# EAGLE design mm8i (EAGLE 6.6.0)
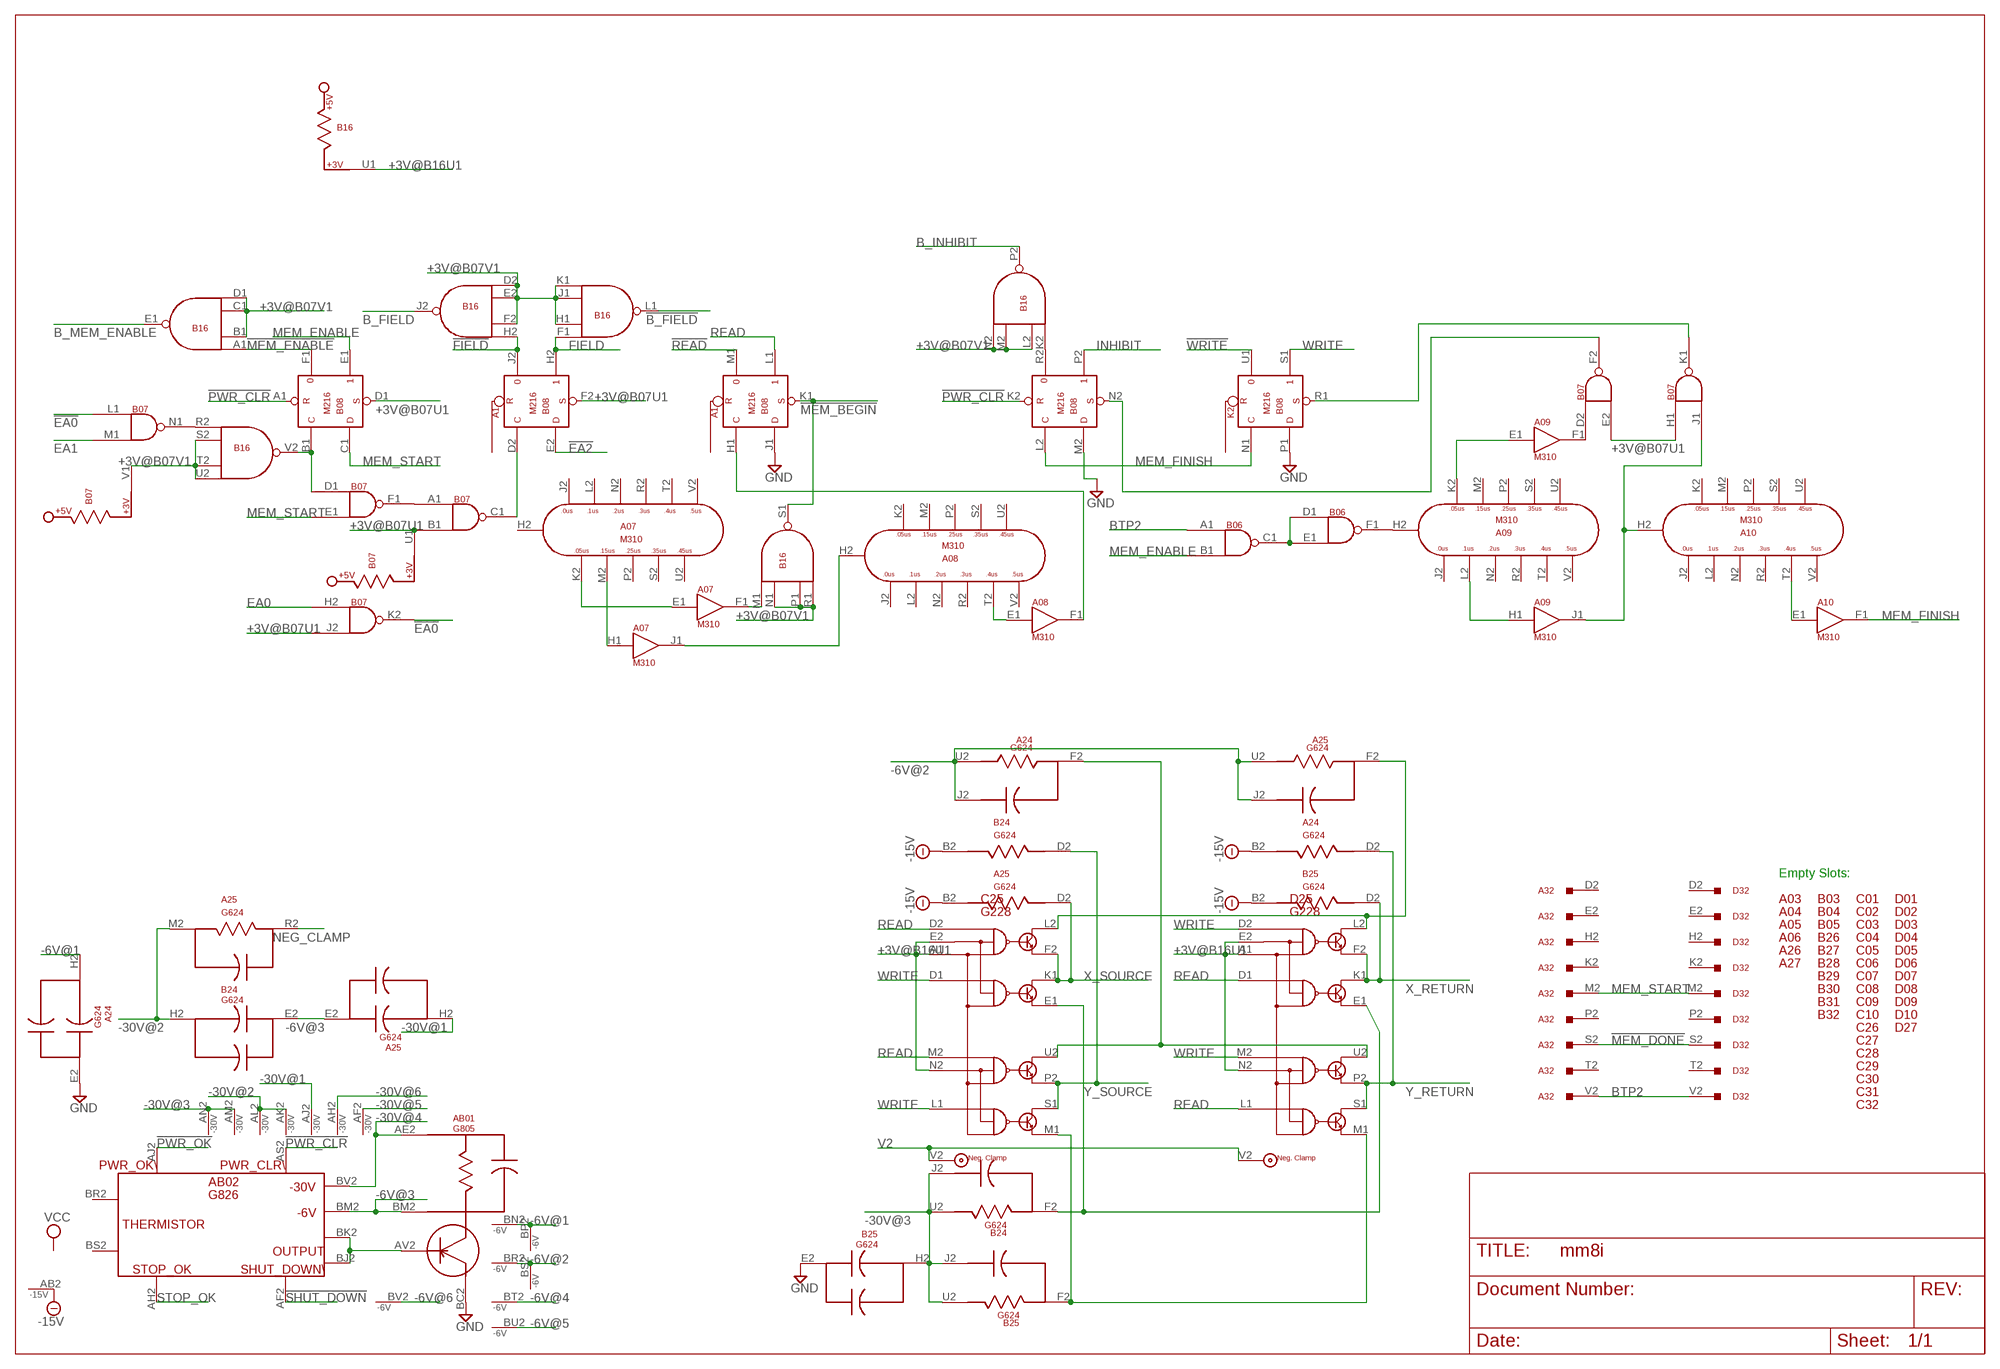
[diagram p0: schematic, sheet 1]

## Parts
A03  H807  [H807]
A04  H807  [H807]
A05  H807  [H807]
A06  H807  [H807]
A07  M310  [H807]
A08  M310  [H807]
A09  M310  [H807]
A10  M310  [H807]
A24  G624  [H807]
A25  G624  [H807]
A26  H807  [H807]
A27  H807  [H807]
A32  W033  W011  [H807]
AB01  G805  [H807-2]
AB02  G826  [H807-2]
B03  H807  [H807]
B04  H807  [H807]
B05  H807  [H807]
B06  M113  [H807]
B07  M113  [H807]
B08  M216  M206X  [H807]
B16  M617  [H807]
B24  G624  [H807]
B25  G624  [H807]
B26  H807  [H807]
B27  H807  [H807]
B28  H807  [H807]
B29  H807  [H807]
B30  H807  [H807]
B31  H807  [H807]
B32  H807  [H807]
C01  H807  [H807]
C02  H807  [H807]
C03  H807  [H807]
C04  H807  [H807]
C05  H807  [H807]
C06  H807  [H807]
C07  H807  [H807]
C08  H807  [H807]
C09  H807  [H807]
C10  H807  [H807]
C25  G228  [H807]
C26  H807  [H807]
C27  H807  [H807]
C28  H807  [H807]
C29  H807  [H807]
C30  H807  [H807]
C31  H807  [H807]
C32  H807  [H807]
D01  H807  [H807]
D02  H807  [H807]
D03  H807  [H807]
D04  H807  [H807]
D05  H807  [H807]
D06  H807  [H807]
D07  H807  [H807]
D08  H807  [H807]
D09  H807  [H807]
D10  H807  [H807]
D25  G228  [H807]
D27  H807  [H807]
D32  W033  W011  [H807]

## Nets
!B_FIELD: B16.L1(L1:OUT)
!EA0: B07.K2(K2:OUT) B07.L1(N1:IN1)
!EA2: B08.E2(H2:D)
!FIELD: B08.J2 B16.H2(J2:IN4)
!MEM_BEGIN: B08.K1(L1:S) B16.S1(S1:OUT)
!MEM_DONE: A32.S2 D32.S2
!MEM_ENABLE: B08.F1 B16.A1(E1:IN1)
!PWR_CLR: AB02.AS2 B08.A1(E1:R) B08.K2(P2:R)
!PWR_OK: AB02.AJ2
!READ: B08.M1
!SHUT_DOWN: AB02.AF2
!WRITE: B08.U1
+3V@B07U1: B07.B1(C1:IN2) B07.E2(F2:IN2) B07.H1(K1:IN1) B07.J2(K2:IN2) B07.U1 B08.D1(E1:S) B08.F2(H2:S)
+3V@B07V1: B07.V1 B16.B1(E1:IN2) B16.C1(E1:IN3) B16.D1(E1:IN4) B16.D2(J2:IN1) B16.E2(J2:IN2) B16.F2(J2:IN3) B16.H1(L1:IN2) B16.J1(L1:IN3) B16.K1(L1:IN4) B16.L2(P2:IN2) B16.M2(P2:IN3) B16.N1(S1:IN2) B16.N2(P2:IN4) B16.P1(S1:IN3) B16.R1(S1:IN4) B16.S2(V2:IN2) B16.T2(V2:IN3) B16.U2(V2:IN4)
+3V@B16U1: B16.U1 C25.A1 C25.E2 C25.N2 D25.A1 D25.E2 D25.N2
-6V@1: A24.H2 AB01.BN2(-6V) AB01.BP2(-6V)
-6V@2: A24.J2 A24.U2 A25.J2 A25.U2 AB01.BR2(-6V) AB01.BS2(-6V)
-6V@3 [supply]: A25.E2 AB01.BM2(-6V) AB02.BM2(-6V) B24.E2
-6V@4: AB01.BT2(-6V)
-6V@5: AB01.BU2(-6V)
-6V@6: AB01.BV2(-6V)
-15V: A24.B2 A25.B2 AB02.AB2(-15V) B24.B2 B25.B2
-30V@1: A25.H2 AB01.AJ2(-30V)
-30V@2: A25.M2 AB01.AK2(-30V) AB01.AL2(-30V) B24.H2
-30V@3: AB01.AM2(-30V) AB01.AN2(-30V) B24.J2 B24.U2 B25.H2 B25.J2 B25.U2
-30V@4 [supply]: AB01.AE2(-30V) AB02.BV2(-30V)
-30V@5: AB01.AF2(-30V)
-30V@6: AB01.AH2(-30V)
B_FIELD: B16.J2(J2:OUT)
B_INHIBIT: B16.P2(P2:OUT)
B_MEM_ENABLE: B16.E1(E1:OUT)
BTP2: A32.V2 B06.A1(C1:IN1) D32.V2
EA0: B07.H2(K2:IN1)
EA1: B07.M1(N1:IN2)
FIELD: B08.H2 B16.F1(L1:IN1)
GND [supply]: A24.E2 AB01.BC2(GND) B08.J1(L1:D) B08.M2(P2:D) B08.P1(S1:D) B25.E2
INHIBIT: B08.P2
MEM_ENABLE: B06.B1(C1:IN2) B08.E1
MEM_FINISH: A10.F1(F1:OUT) B08.L2(P2:C) B08.N1(S1:C)
MEM_START: A32.M2 B07.E1(F1:IN2) B08.C1(E1:D) D32.M2
N$1: AB01.AV2 AB02.BJ2 AB02.BK2
N$2: B06.C1(C1:OUT) B06.D1(F1:IN1) B06.E1(F1:IN2)
N$3: A25.F2 C25.L2 D25.L2
N$4: A24.F2 C25.U2 D25.U2
N$5: B07.N1(N1:OUT) B16.R2(V2:IN1)
N$6: B07.D1(F1:IN1) B08.B1(E1:C) B16.V2(V2:OUT)
N$7: B07.A1(C1:IN1) B07.F1(F1:OUT)
N$8: B07.C1(C1:OUT) B08.D2(H2:C)
N$9: A07.H1(J1:IN) A07.M2(H2:M2)
N$10: A07.E1(F1:IN) A07.K2(H2:K2)
N$11: A07.F1(F1:OUT) B16.M1(S1:IN1)
N$12: A07.J1(J1:OUT) A08.H2(H2:H2)
N$13: A08.E1(F1:IN) A08.T2(H2:T2)
N$14: A08.F1(F1:OUT) B08.H1(L1:C)
N$15: A09.H2(H2:H2) B06.F1(F1:OUT)
N$16: A09.E1(F1:IN) A09.K2(H2:K2)
N$17: A09.H1(J1:IN) A09.L2(H2:L2)
N$18: A09.F1(F1:OUT) B07.D2(F2:IN1)
N$19: B25.F2 C25.M1 D25.M1
N$20: B24.F2 C25.E1 D25.E1
N$21: B07.F2(F2:OUT) B08.N2(P2:S)
N$22: B08.R2 B16.K2(P2:IN1)
N$23: A09.J1(J1:OUT) A10.H2(H2:H2) B07.J1(K1:IN2)
N$24: A10.E1(F1:IN) A10.T2(H2:T2)
N$25: B07.K1(K1:OUT) B08.R1(S1:S)
NEG_CLAMP: A25.R2
READ: B08.L1 C25.D2 C25.M2 D25.D1 D25.L1
STOP_OK: AB02.AH2
V2: C25.V2 D25.V2
WRITE: B08.S1 C25.D1 C25.L1 D25.D2 D25.M2
X_RETURN: B25.D2 D25.F2 D25.K1
X_SOURCE: A25.D2 C25.F2 C25.K1
Y_RETURN: A24.D2 D25.P2 D25.S1
Y_SOURCE: B24.D2 C25.P2 C25.S1
Unconnected: A07.H2(H2:H2) A07.J2(H2:J2) A07.L2(H2:L2) A07.N2(H2:N2) A07.P2(H2:P2) A07.R2(H2:R2) A07.S2(H2:S2) A07.T2(H2:T2) A07.U2(H2:U2) A07.V2(H2:V2) A08.H1(J1:IN) A08.J1(J1:OUT) A08.J2(H2:J2) A08.K2(H2:K2) A08.L2(H2:L2) A08.M2(H2:M2) A08.N2(H2:N2) A08.P2(H2:P2) A08.R2(H2:R2) A08.S2(H2:S2) A08.U2(H2:U2) A08.V2(H2:V2) A09.J2(H2:J2) A09.M2(H2:M2) A09.N2(H2:N2) A09.P2(H2:P2) A09.R2(H2:R2) A09.S2(H2:S2) A09.T2(H2:T2) A09.U2(H2:U2) A09.V2(H2:V2) A10.H1(J1:IN) A10.J1(J1:OUT) A10.J2(H2:J2) A10.K2(H2:K2) A10.L2(H2:L2) A10.M2(H2:M2) A10.N2(H2:N2) A10.P2(H2:P2) A10.R2(H2:R2) A10.S2(H2:S2) A10.U2(H2:U2) A10.V2(H2:V2) A24.C2 A24.K2 A24.L2 A24.M2 A24.N2 A24.P2 A24.R2 A24.S2 A24.T2 A24.V2 A25.C2 A25.K2 A25.L2 A25.N2 A25.P2 A25.S2 A25.T2 A25.V2 A32.D2 A32.E2 A32.H2 A32.K2 A32.P2 A32.T2 AB02.BR2 AB02.BS2 B06.D2(F2:IN1) B06.E2(F2:IN2) B06.F2(F2:OUT) B06.H1(K1:IN1) B06.H2(K2:IN1) B06.J1(K1:IN2) B06.J2(K2:IN2) B06.K1(K1:OUT) B06.K2(K2:OUT) B06.L1(N1:IN1) B06.L2(N2:IN1) B06.M1(N1:IN2) B06.M2(N2:IN2) B06.N1(N1:OUT) B06.N2(N2:OUT) B06.P1(S1:IN1) B06.P2(S2:IN1) B06.R1(S1:IN2) B06.R2(S2:IN2) B06.S1(S1:OUT) B06.S2(S2:OUT) B06.T2(V2:IN1) B06.U1 B06.U2(V2:IN2) B06.V1 B06.V2(V2:OUT) B07.L2(N2:IN1) B07.M2(N2:IN2) B07.N2(N2:OUT) B07.P1(S1:IN1) B07.P2(S2:IN1) B07.R1(S1:IN2) B07.R2(S2:IN2) B07.S1(S1:OUT) B07.S2(S2:OUT) B07.T2(V2:IN1) B07.U2(V2:IN2) B07.V2(V2:OUT) B08.S2(V2:C) B08.T2(V2:D) B08.U2(V2:S) B08.V1 B08.V2 B16.V1 B24.C2 B24.K2 B24.L2 B24.M2 B24.N2 B24.P2 B24.R2 B24.S2 B24.T2 B24.V2 B25.C2 B25.K2 B25.L2 B25.M2 B25.N2 B25.P2 B25.R2 B25.S2 B25.T2 B25.V2 C25.F1(F1:H) C25.H1(F1:J) C25.H2(H2:H) C25.J1(F1:K) C25.J2(H2:J) C25.K2(H2:K) C25.N1(N1:H) C25.P1(N1:J) C25.R1(N1:K) C25.R2(R2:H) C25.S2(R2:J) C25.T2(R2:K) D25.F1(F1:H) D25.H1(F1:J) D25.H2(H2:H) D25.J1(F1:K) D25.J2(H2:J) D25.K2(H2:K) D25.N1(N1:H) D25.P1(N1:J) D25.R1(N1:K) D25.R2(R2:H) D25.S2(R2:J) D25.T2(R2:K) D32.D2 D32.E2 D32.H2 D32.K2 D32.P2 D32.T2

## Notes on the sheet
- Empty Slots:

## Power pins joined to a net without a drawn wire
GND: A07.C2(GND) A07.T1(GND) A08.C2(GND) A08.T1(GND) A09.C2(GND) A09.T1(GND) A10.C2(GND) A10.T1(GND) A32.C2 A32.F2 A32.J2 A32.L2 A32.N2 A32.R2 A32.U2 AB01.AP2(GND) AB01.AR2(GND) AB01.AS2(GND) AB01.AT2(GND) AB01.AU2(GND) AB01.BD2(GND) AB01.BE2(GND) AB01.BF2(GND) AB01.BH2(GND) AB01.BJ2(GND) AB01.BK2(GND) AB01.BL2(GND) AB02.AC2(GND) AB02.BC2(GND) B06.C2(GND) B06.T1(GND) B07.C2(GND) B07.T1(GND) B08.C2(GND) B08.T1(GND) B16.C2(GND) B16.T1(GND) C25.C2(C2:GND) C25.T1(T1:GND) D25.C2(C2:GND) D25.T1(T1:GND) D32.C2 D32.F2 D32.J2 D32.L2 D32.N2 D32.R2 D32.U2
VCC: A07.A2(VCC) A08.A2(VCC) A09.A2(VCC) A10.A2(VCC) AB02.AA2(VCC) AB02.BA2(VCC) B06.A2(VCC) B07.A2(VCC) B08.A2(VCC) B16.A2(VCC) C25.A2(C2:VCC) D25.A2(C2:VCC)

## Library data of the parts
A03-A06 A26 A27 B03-B05 B26-B32 C01-C09 C10 C26-C32 D01-D09 D10 D27 = dec-m:H807: Empty card slot
A07-A09 A10 = dec-m:M310: Tapped Delay Line
A24 A25 B24 B25 = dec-m:G624: Resistor Board
A32 D32 = dec-m:W011: One-sided 9 pin connector/cable with grounds (Negibus).
AB01 = dec-m:G805: Negative Regulator
AB02 = dec-m:G826: Regulator and Power Detector
B06 B07 = dec-m:M113: 10 2-input NAND Gates
B08 = dec-m:M206X: Two sets of 3 D flip-flops
B16 = dec-m:M617: 6 4-input NAND Buffers
C25 D25 = dec-m:G228: Inhibit Driver

## Net classes
1 supply: width 0.508 mm

## Board
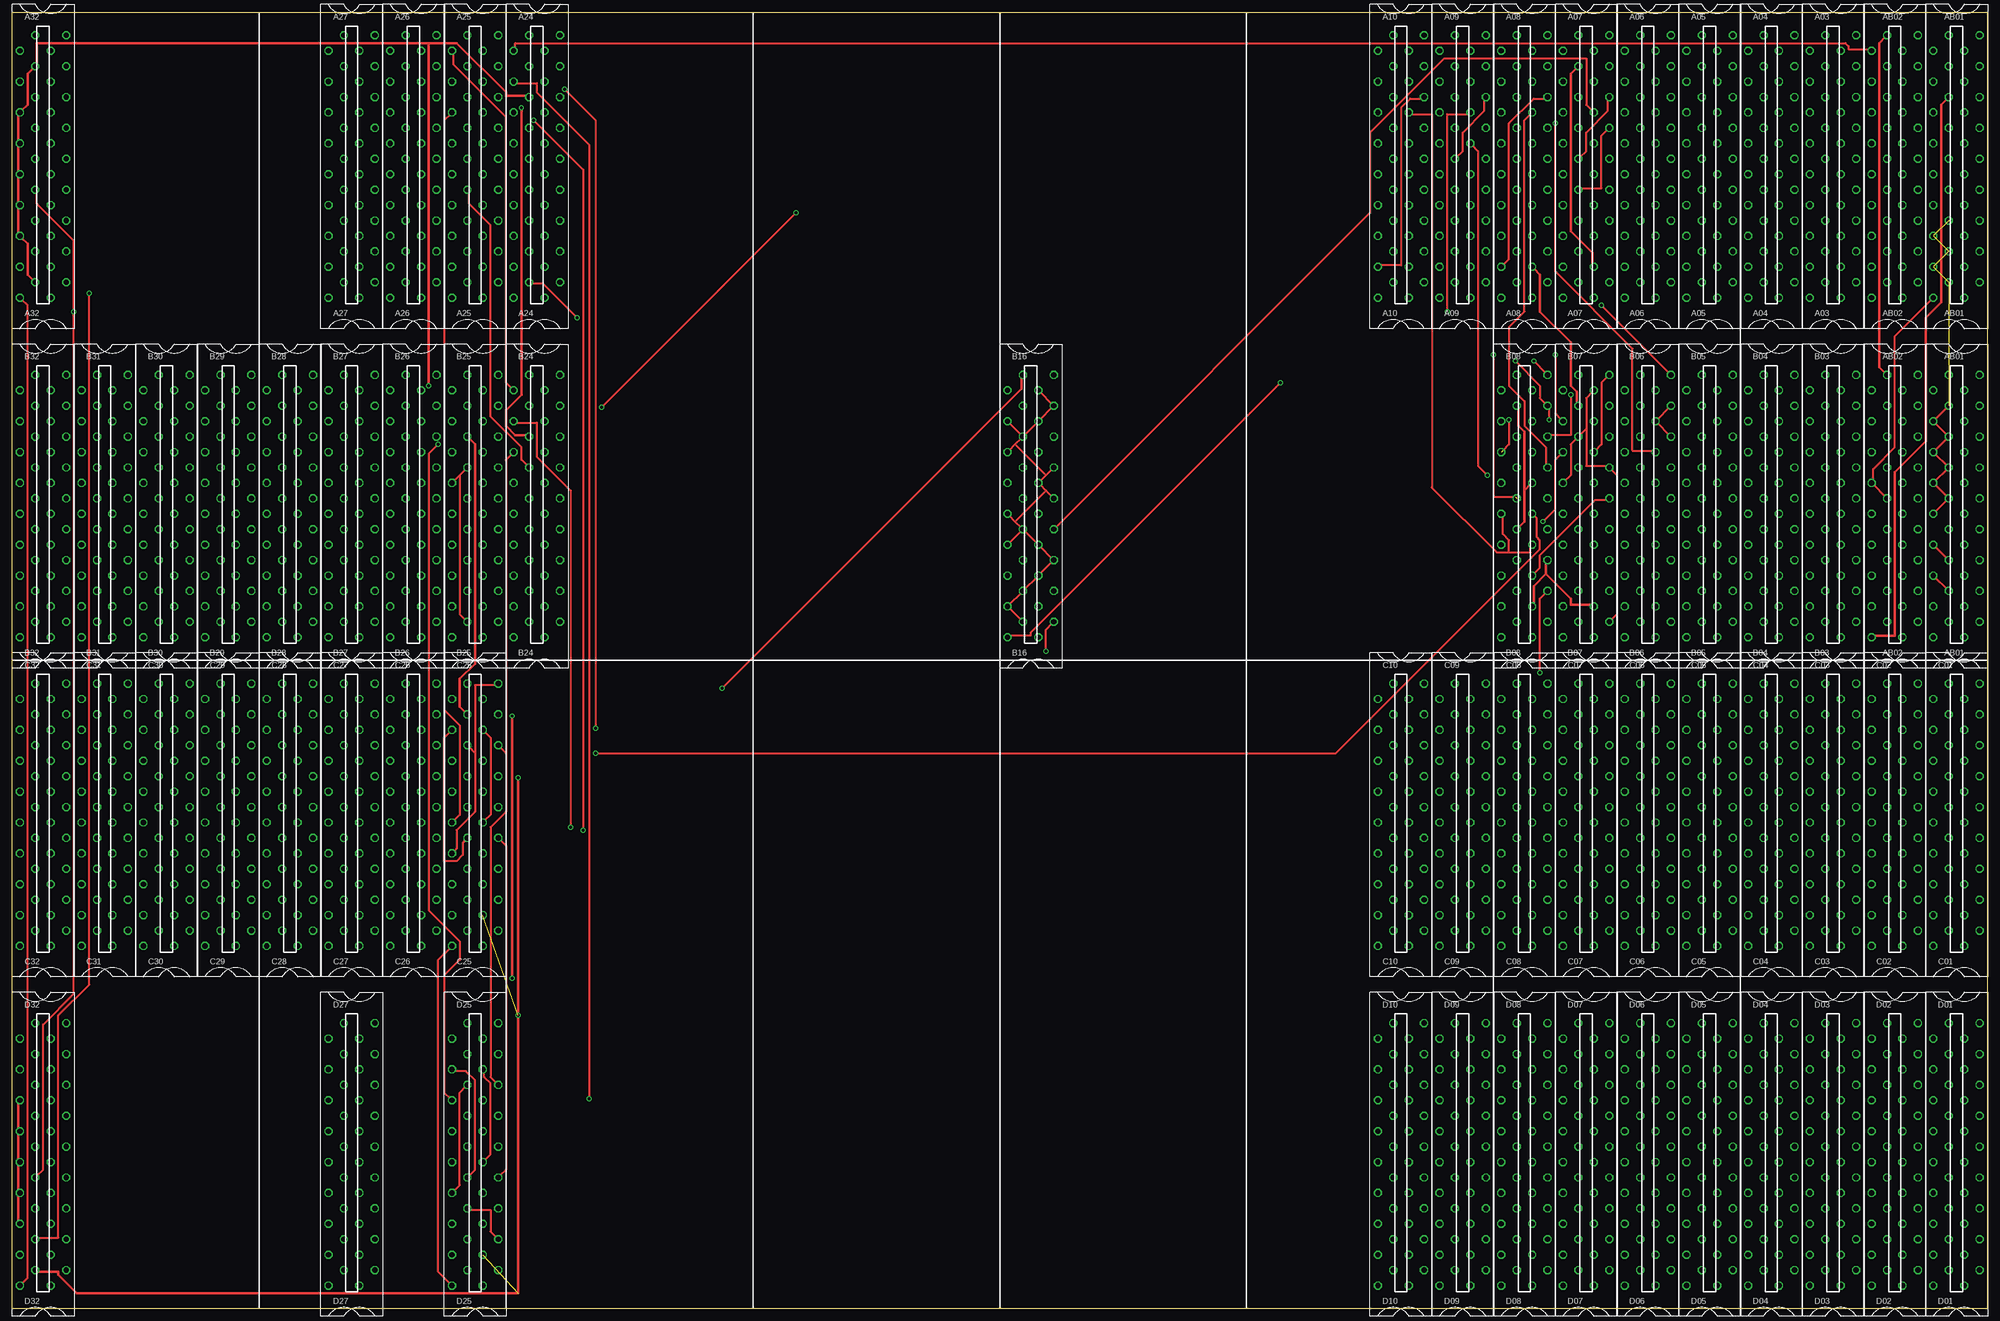
[diagram p1: board, top side]
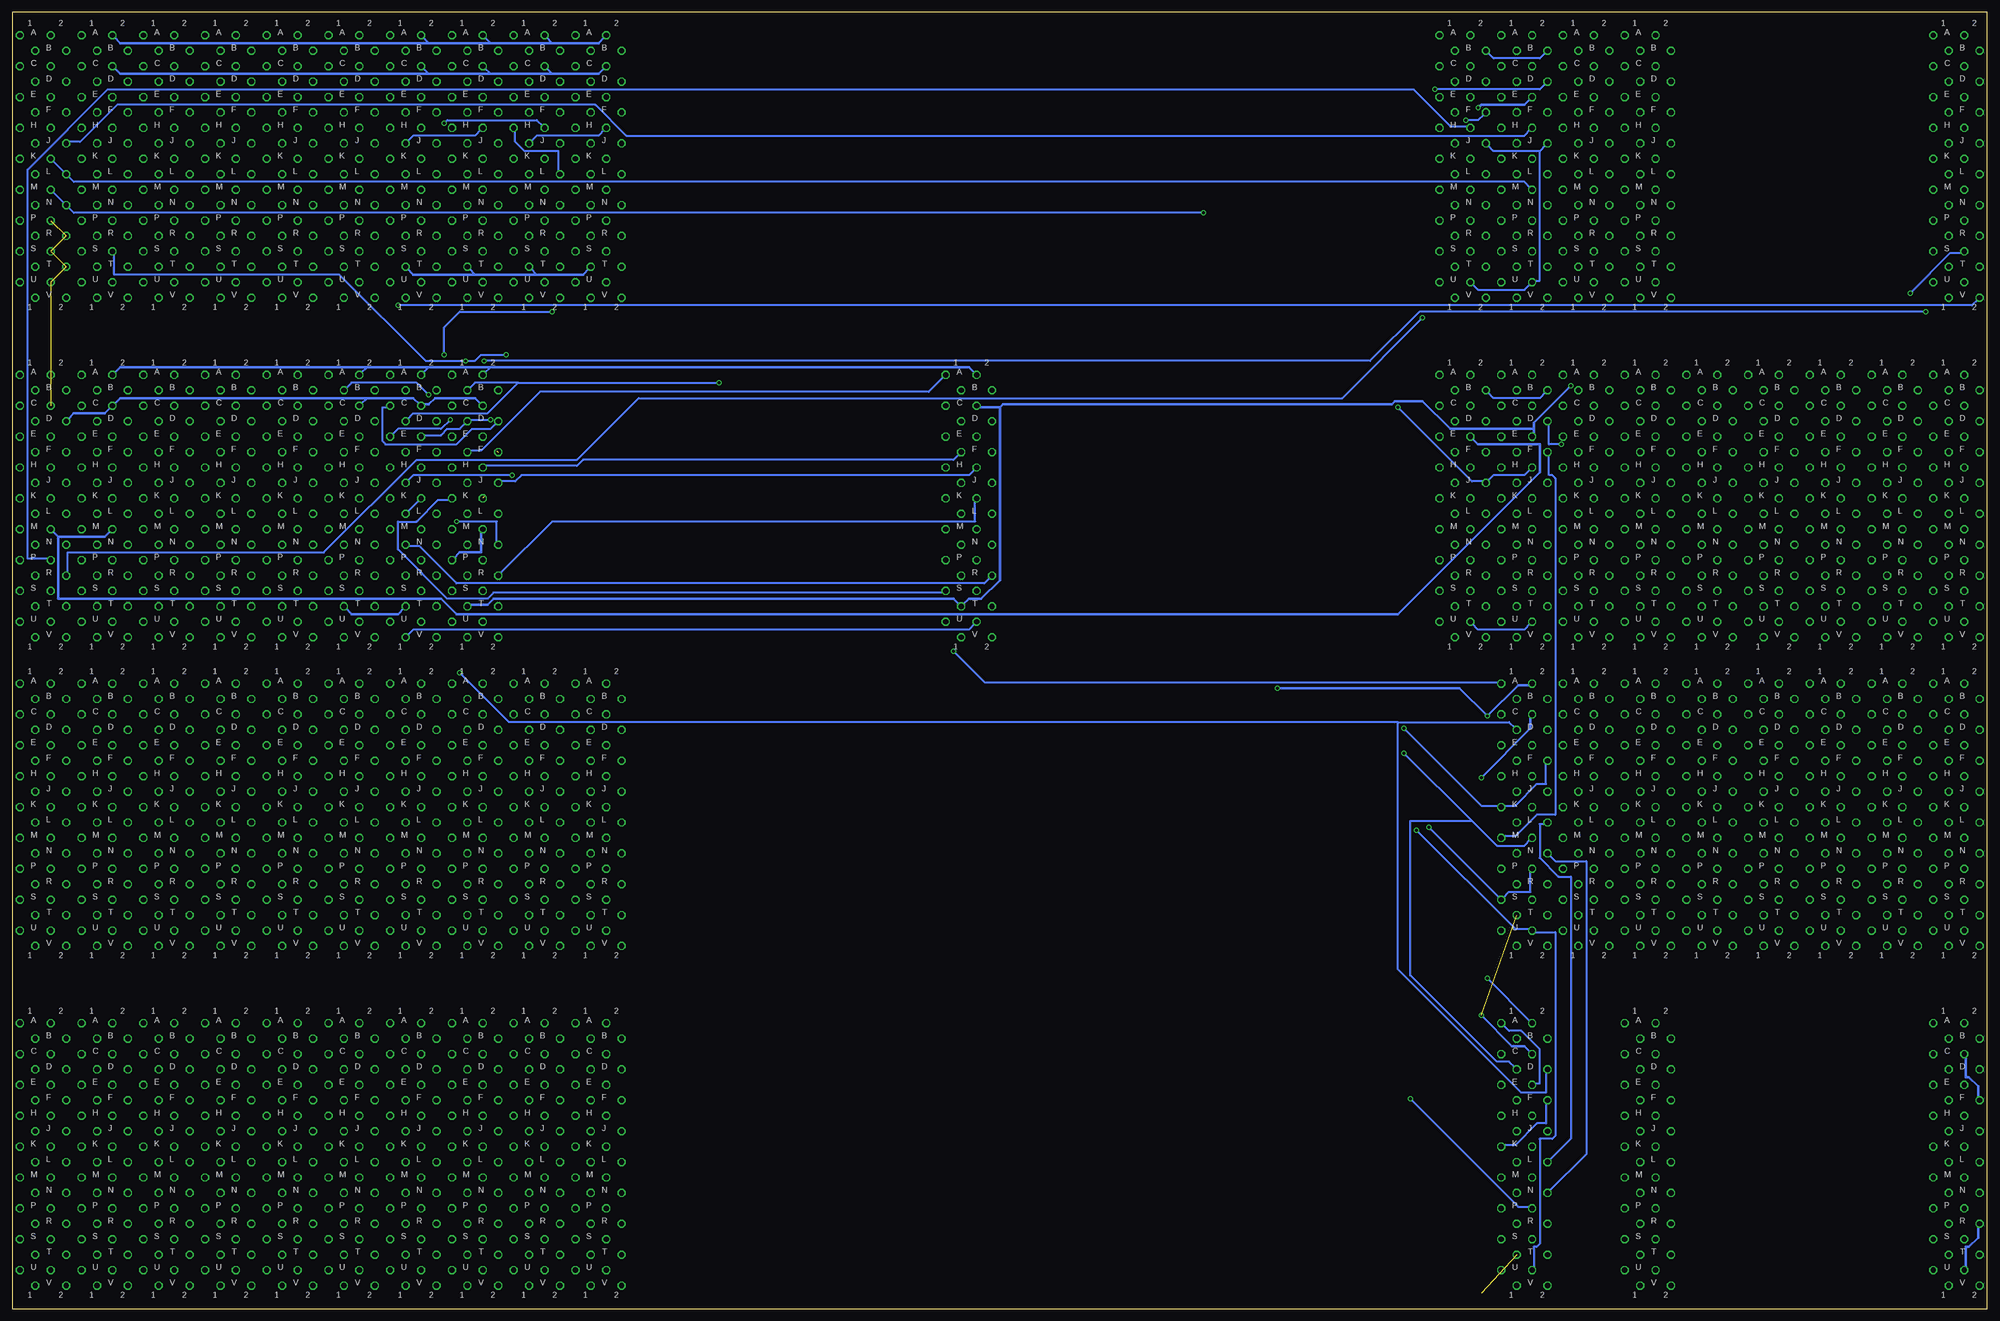
[diagram p2: board, bottom side, seen from below]

Size 406.4 x 266.7 mm. Coordinates in mm from the lower left corner, seen from the top.
Outline: 0,0 0,266.7 406.4,266.7 406.4,0 0,0
Copper layers (1*16): Top 0.035mm / dielectric 1.5mm / Bottom 0.035mm
Design rules "15mils": minimum track width 15mil, minimum drill 24mil, track to track 15mil, track to pad 10mil, pad to pad 10mil, via to via 10mil, smd to smd 10mil, copper to edge 25mil, drill to drill 10mil, minimum pad ring 10mil, minimum via ring 8mil, stop-mask expansion 0mil, vias tented up to drill 0mil, thermal gap 10mil

### Footprints (pad centres in the part's own frame; a part is rotated, then mirrored left to right if it is on the bottom)
H807 = drill 1.092 octagon: A1 4.763,28.575; A2 -1.587,28.575; B1 1.587,25.4; B2 -4.763,25.4; C1 4.763,22.225; C2 -1.587,22.225; D1 1.587,19.05; D2 -4.763,19.05; E1 4.763,15.875; E2 -1.587,15.875; F1 1.587,12.7; F2 -4.763,12.7; H1 4.763,9.525; H2 -1.587,9.525; J1 1.587,6.35; J2 -4.763,6.35; K1 4.763,3.175; K2 -1.587,3.175; L1 1.587,0; L2 -4.763,0; M1 4.763,-3.175; M2 -1.587,-3.175; N1 1.587,-6.35; N2 -4.763,-6.35; P1 4.763,-9.525; P2 -1.587,-9.525; R1 1.587,-12.7; R2 -4.763,-12.7; S1 4.763,-15.875; S2 -1.587,-15.875; T1 1.587,-19.05; T2 -4.763,-19.05; U1 4.763,-22.225; U2 -1.587,-22.225; V1 1.587,-25.4; V2 -4.763,-25.4
H807-2 = drill 1.092 octagon: AA1 4.763,60.325; AA2 -1.587,60.325; AB1 1.587,57.15; AB2 -4.763,57.15; AC1 4.763,53.975; AC2 -1.587,53.975; AD1 1.587,50.8; AD2 -4.763,50.8; AE1 4.763,47.625; AE2 -1.587,47.625; AF1 1.587,44.45; AF2 -4.763,44.45; AH1 4.763,41.275; AH2 -1.587,41.275; AJ1 1.587,38.1; AJ2 -4.763,38.1; AK1 4.763,34.925; AK2 -1.587,34.925; AL1 1.587,31.75; AL2 -4.763,31.75; AM1 4.763,28.575; AM2 -1.587,28.575; AN1 1.587,25.4; AN2 -4.763,25.4; AP1 4.763,22.225; AP2 -1.587,22.225; AR1 1.587,19.05; AR2 -4.763,19.05; AS1 4.763,15.875; AS2 -1.587,15.875; AT1 1.587,12.7; AT2 -4.763,12.7; AU1 4.763,9.525; AU2 -1.587,9.525; AV1 1.587,6.35; AV2 -4.763,6.35; BA1 4.763,-9.525; BA2 -1.587,-9.525; BB1 1.587,-12.7; BB2 -4.763,-12.7; BC1 4.763,-15.875; BC2 -1.587,-15.875; BD1 1.587,-19.05; BD2 -4.763,-19.05; BE1 4.763,-22.225; BE2 -1.587,-22.225; BF1 1.587,-25.4; BF2 -4.763,-25.4; BH1 4.763,-28.575; BH2 -1.587,-28.575; BJ1 1.587,-31.75; BJ2 -4.763,-31.75; BK1 4.763,-34.925; BK2 -1.587,-34.925; BL1 1.587,-38.1; BL2 -4.763,-38.1; BM1 4.763,-41.275; BM2 -1.587,-41.275; BN1 1.587,-44.45; BN2 -4.763,-44.45; BP1 4.763,-47.625; BP2 -1.587,-47.625; BR1 1.587,-50.8; BR2 -4.763,-50.8; BS1 4.763,-53.975; BS2 -1.587,-53.975; BT1 1.587,-57.15; BT2 -4.763,-57.15; BU1 4.763,-60.325; BU2 -1.587,-60.325; BV1 1.587,-63.5; BV2 -4.763,-63.5

### Placement (x,y rotation side)
A03  374.65,233.36 0 top
A04  361.95,233.36 0 top
A05  349.25,233.36 0 top
A06  336.55,233.36 0 top
A07  323.85,233.36 0 top
A08  311.15,233.36 0 top
A09  298.45,233.36 0 top
A10  285.75,233.36 0 top
A24  107.95,233.36 0 top
A25  95.25,233.36 0 top
A26  82.55,233.36 0 top
A27  69.85,233.36 0 top
A32  6.35,233.36 0 top
AB01  400.05,201.61 0 top
AB02  387.35,201.61 0 top
B03  374.65,163.51 0 top
B04  361.95,163.51 0 top
B05  349.25,163.51 0 top
B06  336.55,163.51 0 top
B07  323.85,163.51 0 top
B08  311.15,163.51 0 top
B16  209.55,163.51 0 top
B24  107.95,163.51 0 top
B25  95.25,163.51 0 top
B26  82.55,163.51 0 top
B27  69.85,163.51 0 top
B28  57.15,163.51 0 top
B29  44.45,163.51 0 top
B30  31.75,163.51 0 top
B31  19.05,163.51 0 top
B32  6.35,163.51 0 top
C01  400.05,100.01 0 top
C02  387.35,100.01 0 top
C03  374.65,100.01 0 top
C04  361.95,100.01 0 top
C05  349.25,100.01 0 top
C06  336.55,100.01 0 top
C07  323.85,100.01 0 top
C08  311.15,100.01 0 top
C09  298.45,100.01 0 top
C10  285.75,100.01 0 top
C25  95.25,100.01 0 top
C26  82.55,100.01 0 top
C27  69.85,100.01 0 top
C28  57.15,100.01 0 top
C29  44.45,100.01 0 top
C30  31.75,100.01 0 top
C31  19.05,100.01 0 top
C32  6.35,100.01 0 top
D01  400.05,30.16 0 top
D02  387.35,30.16 0 top
D03  374.65,30.16 0 top
D04  361.95,30.16 0 top
D05  349.25,30.16 0 top
D06  336.55,30.16 0 top
D07  323.85,30.16 0 top
D08  311.15,30.16 0 top
D09  298.45,30.16 0 top
D10  285.75,30.16 0 top
D25  95.25,30.16 0 top
D27  69.85,30.16 0 top
D32  6.35,30.16 0 top
U$1  [CBLOCK]  0,0 0 top
U$2  [CBLOCK]  50.8,0 0 top
U$3  [CBLOCK]  101.6,0 0 top
U$4  [CBLOCK]  152.4,0 0 top
U$5  [CBLOCK]  203.2,0 0 top
U$6  [CBLOCK]  254,0 0 top
U$7  [CBLOCK]  304.8,0 0 top
U$8  [CBLOCK]  355.6,0 0 top
U$9  [CBLOCK]  0,133.35 0 top
U$10  [CBLOCK]  50.8,133.35 0 top
U$11  [CBLOCK]  101.6,133.35 0 top
U$12  [CBLOCK]  152.4,133.35 0 top
U$13  [CBLOCK]  203.2,133.35 0 top
U$14  [CBLOCK]  254,133.35 0 top
U$15  [CBLOCK]  355.6,133.35 0 top
U$16  [CBLOCK]  304.8,133.35 0 top

### Tracks (layer width: path | path; a pad name or v marks a point on that pad's centre or on a via)
!EA0
  Bottom 0.381: B07.K2 322.58,166.37 325.12,163.83 B07.L1
!FIELD
  Bottom 0.381: B16.H2 208.28,172.72 209.55,171.45 301.62,171.45 302.89,170.18 306.07,170.18 B08.J2
!MEM_BEGIN
  Bottom 0.381: B16.S1 214.63,147.32 307.34,147.32 308.61,146.05 316.87,146.05 327.02,156.21 327.02,161.93 323.21,161.93 318.77,166.37 316.23,166.37 B08.K1
!MEM_DONE  (via drill 0.61)
  Top 0.381: v15.88,208.91 15.88,66.67 9.53,60.33 9.53,14.61 5.08,14.61 D32.S2
  Bottom 0.381: v15.88,208.91 7.62,217.17 5.08,217.17 A32.S2
!MEM_ENABLE
  Bottom 0.381: B16.A1 214.63,191.77 217.81,188.59 297.81,188.59 309.88,176.53 312.42,176.53 B08.F1
!PWR_CLR  (via drill 0.61)  (1 unrouted)
  Top 0.381: 309.25,167 304.8,167 v304.8,196.22 | v313.06,194.94 315.6,192.41 B08.A1
  Bottom 0.381: v304.8,196.22 309.88,196.22 311.15,194.94 v313.06,194.94 321.31,194.94 339.09,212.72 385.44,212.72 385.44,217.17 AB02.AS2
+3V@B07U1  (via drill 0.61)  (1 unrouted)
  Top 0.381: B07.U1 328.93,141.6 330.2,142.88 330.2,171.45 328.93,172.72 B07.H1 328.3,173.35 323.85,173.35 323.85,180.97 | 306.7,176.53 307.98,177.8 v307.98,182.88 | B07.J2 319.4,170.18 320.68,171.45 320.68,177.8 321.94,179.07 B07.E2 322.58,179.71 323.85,180.97 | 323.85,180.97 323.85,187.32 325.12,188.59 B07.B1
  Bottom 0.381: v307.98,182.88 312.42,182.88 B08.D1 313.06,182.25 314.32,180.97 316.87,180.97 318.13,179.71 321.94,179.71 B07.E2
+3V@B07V1
  Top 0.381: 206.38,177.8 207.65,179.07 B16.E2 | 206.38,177.8 205.1,176.53 B16.F2 | B16.D2 205.1,182.25 207.65,179.71 B16.E2 | B16.E2 208.28,179.71 210.82,182.25 B16.D1 211.46,182.88 214,185.42 B16.C1 214,186.06 211.46,188.59 B16.B1 | 212.72,168.28 211.46,169.54 B16.J1 211.46,170.18 212.72,171.45 | 212.72,168.28 214,167 B16.K1 | 212.72,171.45 214,172.72 B16.H1 | B16.N2 205.1,157.48 207.65,160.02 B16.M2 | 206.38,161.93 207.65,160.66 B16.M2 | 206.38,161.93 205.1,163.19 B16.L2 | B16.U2 207.65,141.6 205.1,144.15 B16.T2 205.1,144.78 207.65,147.32 B16.S2 208.28,147.96 210.82,150.5 B16.R1 211.46,151.13 214,153.67 B16.P1 214,154.31 211.46,156.84 B16.N1 210.82,157.48 208.28,160.02 B16.M2 | 206.38,161.93 212.72,168.28 | 212.72,171.45 206.38,177.8
  Bottom 0.381: B07.V1 325.12,138.43 323.85,139.7 209.55,139.7 208.28,140.97 B16.U2
+3V@B16U1  (via drill 0.61)
  Top 0.381: D25.N2 90.81,24.13 92.08,25.4 92.08,44.45 93.34,45.72 D25.E2 | 95.25,114.3 95.25,102.23 91.44,98.42 91.44,94.61 90.81,93.98 C25.N2 | 95.25,114.3 93.98,115.57 C25.E2 | 95.25,114.3 95.25,128.27 99.69,128.27 C25.A1 | v212.72,135.25 212.72,139.7 214,140.97 B16.U1
  Bottom 0.381: D25.A1 99.69,58.42 98.42,57.15 95.89,57.15 92.08,53.34 92.08,46.35 93.34,46.35 D25.E2 | v212.72,135.25 206.38,128.91 100.33,128.91 C25.A1 | D25.N2 90.17,24.13 82.55,31.75 82.55,92.08 88.9,92.08 90.17,93.34 C25.N2
-6V@1
  Top 0.381: AB01.BP2 398.14,154.31 395.61,156.84 AB01.BN2
  Bottom 0.381: A24.H2 106.68,243.21 110.49,243.21 118.11,250.82 386.71,250.82 403.23,234.31 403.23,154.31 398.78,154.31 AB01.BP2
-6V@2  (via drill 0.61)
  Top 0.381: AB01.BS2 398.14,147.96 395.61,150.5 AB01.BR2 | v116.2,203.84 109.22,210.82 106.68,210.82 A24.U2
  Bottom 0.381: 92.08,238.12 90.81,239.4 A25.J2 | 92.08,238.12 101.6,238.12 102.87,239.4 A24.J2 | A24.U2 106.05,210.82 104.78,209.55 95.25,209.55 93.98,210.82 A25.U2 93.34,211.46 92.08,211.46 92.08,238.12 | v116.2,203.84 132.72,187.32 277.5,187.32 290.19,174.62 323.21,174.62 342.26,155.57 394.97,155.57 394.97,151.13 AB01.BR2
-6V@3  (via drill 0.61)
  Top 0.508: v104.78,247.01 104.78,187.96 101.6,184.78 101.6,181.61 103.5,179.71 106.05,179.71 B24.E2
  Bottom 0.508: 396.88,158.75 387.35,158.75 386.08,160.02 AB02.BM2 | 396.88,158.75 398.14,160.02 AB01.BM2 | v104.78,247.01 104.14,247.65 95.25,247.65 93.98,248.92 A25.E2 | 396.88,158.75 396.88,146.05 318.13,146.05 314.96,142.88 121.28,142.88 92.08,172.09 92.08,177.8 104.78,177.8 106.05,179.07 B24.E2
-15V
  Top 0.381: AB02.AB2 382.27,259.08 377.82,259.08 377.82,259.71 377.19,260.35 103.5,260.35 103.5,259.08 A24.B2 | B24.B2 102.87,189.23 101.6,190.5 101.6,245.11 90.81,255.91 90.81,258.44 A25.B2
  Bottom 0.381: B25.B2 90.81,188.59 92.08,187.32 101.6,187.32 102.87,188.59 B24.B2 | A25.B2 90.81,258.44 92.08,257.18 101.6,257.18 102.87,258.44 A24.B2
-30V@1
  Bottom 0.381: A25.H2 93.98,242.57 95.25,241.3 280.04,241.3 286.38,247.65 384.81,247.65 392.43,240.03 394.97,240.03 AB01.AJ2
-30V@2
  Top 0.381: B24.H2 106.05,173.35 104.78,174.62 104.78,177.16 98.42,183.51 98.42,222.88 93.98,227.33 93.98,229.87 A25.M2
  Bottom 0.381: AB01.AK2 398.14,236.22 395.61,233.68 AB01.AL2 394.97,233.04 393.7,231.78 95.25,231.78 93.98,230.5 A25.M2
-30V@3  (via drill 0.61)
  Top 0.381: 92.08,171.45 93.34,172.72 B25.H2 | 92.08,171.45 90.81,170.18 B25.J2 | v121.28,185.42 v161.29,225.43 | 92.08,171.45 92.08,142.88 93.34,141.6 B25.U2
  Bottom 0.381: B25.U2 93.98,140.97 95.25,139.7 104.78,139.7 106.05,140.97 B24.U2 | AB01.AM2 398.14,229.87 395.61,227.33 AB01.AN2 394.97,226.69 393.7,225.43 v161.29,225.43 | B25.H2 93.98,172.72 95.25,171.45 101.6,171.45 102.87,170.18 B24.J2 103.5,170.18 106.05,170.18 v121.28,185.42
-30V@4
  Top 0.508: AB02.BV2 382.9,138.43 387.35,138.43 387.35,172.09 393.7,178.44 393.7,203.84 396.88,207.01 396.88,247.65 398.14,248.92 AB01.AE2
BTP2  (via drill 0.61)
  Top 0.381: D32.V2 1.91,5.08 3.17,6.35 3.17,206.38 1.91,207.65 A32.V2 | v327.02,206.38 341,192.41 B06.A1
  Bottom 0.381: v327.02,206.38 3.17,206.38 1.91,207.65 A32.V2
FIELD
  Bottom 0.381: B16.F1 211.46,175.9 212.72,174.62 288.93,174.62 290.19,173.35 309.25,173.35 B08.H2
GND  (via drill 0.61)  (7 unrouted)
  Top 0.508: AB01.BL2 395.61,163.83 398.14,166.37 AB01.BK2 398.14,167 395.61,169.54 AB01.BJ2 395.61,170.18 398.14,172.72 AB01.BH2 398.14,173.35 395.61,175.9 AB01.BF2 395.61,176.53 398.14,179.07 AB01.BE2 398.14,179.71 395.61,182.25 AB01.BD2 395.61,182.88 398.14,185.42 AB01.BC2 | 311.15,168.28 311.15,161.93 309.88,160.66 B08.M2 | 311.15,168.28 312.42,169.54 B08.J1 | 315.6,151.13 313.06,148.59 313.06,144.78 B08.T1 | 315.6,151.13 315.6,153.67 B08.P1 | 315.6,151.13 320.68,146.05 320.68,144.78 325.12,144.78 B07.T1 | 311.15,168.28 311.15,180.34 309.88,181.61 309.88,185.42 B08.C2 | A08.T1 313.06,214 314.32,212.72 314.32,205.1 320.68,198.75 320.68,189.87 321.94,188.59 321.94,186.06 B07.C2 | A07.C2 321.94,255.27 320.68,254 320.68,221.62 325.12,217.17 325.12,214.63 A07.T1 | A32.U2 4.45,211.46 3.17,212.72 3.17,219.07 1.91,220.34 A32.R2 1.27,220.98 1.27,226.69 A32.N2 1.27,227.33 1.27,233.04 A32.L2 1.27,233.68 1.27,239.4 A32.J2 1.27,240.03 1.27,245.75 A32.F2 1.91,246.38 3.17,247.65 3.17,254 4.45,255.27 A32.C2 5.08,255.91 5.08,260.35 85.72,260.35 | 85.72,260.35 91.44,260.35 101.6,250.19 101.6,249.56 106.05,249.56 A24.E2 | D32.R2 1.27,17.78 1.27,23.5 D32.N2 1.27,24.13 1.27,29.84 D32.L2 1.27,30.48 1.27,36.2 D32.J2 1.27,36.83 1.27,42.55 D32.F2 | v104.14,109.22 v104.14,60.33 104.14,3.17 13.34,3.17 9.53,6.99 9.53,7.62 5.08,7.62 D32.U2 | B25.E2 93.98,179.07 95.25,177.8 95.25,132.72 92.08,129.54 92.08,123.83 93.34,122.56 C25.C2 | v85.72,189.87 85.72,260.35
  Bottom 0.508: 295.27,254 285.75,254 284.48,255.27 A10.C2 | 295.27,254 296.55,255.27 A09.C2 | 307.98,254 309.25,255.27 A08.C2 | 307.98,254 295.27,254 | 320.68,254 321.94,255.27 A07.C2 | 320.68,254 307.98,254 | 320.68,254 384.18,254 385.44,255.27 AB02.AC2 | 203.2,185.42 203.2,149.86 207.01,146.05 209.55,146.05 210.82,144.78 B16.T1 211.46,144.78 212.72,146.05 307.34,146.05 308.61,144.78 312.42,144.78 B08.T1 | 203.2,185.42 207.65,185.42 B16.C2 | 298.45,212.72 288.93,212.72 287.65,214 A10.T1 | 298.45,212.72 299.72,214 A09.T1 | 311.15,212.72 312.42,214 A08.T1 | 311.15,212.72 298.45,212.72 | 311.15,212.72 323.85,212.72 325.12,214 A07.T1 | AB01.BD2 394.97,182.88 393.7,184.15 387.35,184.15 386.08,185.42 AB02.BC2 385.44,186.06 384.18,187.32 333.38,187.32 | B08.C2 309.88,186.06 311.15,187.32 319.4,187.32 320.68,186.06 321.94,186.06 B07.C2 322.58,186.06 323.85,187.32 333.38,187.32 | 333.38,187.32 334.64,186.06 B06.C2 | B07.T1 325.75,144.15 327.02,142.88 336.55,142.88 337.82,144.15 B06.T1 | B08.M2 309.88,160.02 309.88,155.57 314.32,155.57 315.6,154.31 B08.P1 | D32.U2 4.45,8.26 4.45,12.7 3.81,12.7 1.91,14.61 1.91,17.14 D32.R2 | D32.C2 4.45,52.07 4.45,47.62 3.81,47.62 1.91,45.72 1.91,43.18 D32.F2 | v104.14,60.33 97.79,53.98 95.25,53.98 93.98,52.7 D25.C2 | v104.14,109.22 93.98,119.38 93.98,121.92 C25.C2 | v85.72,189.87 93.34,182.25 93.34,180.97 | 93.34,180.97 93.34,179.71 B25.E2 | 203.2,185.42 202.56,186.06 122.56,186.06 121.92,186.69 116.2,186.69 110.49,180.97 93.34,180.97
MEM_ENABLE  (via drill 0.61)
  Top 0.381: v320.68,187.96 320.68,179.71 316.23,179.71 B08.E1
  Bottom 0.381: v320.68,187.96 323.21,190.5 336.55,190.5 337.82,189.23 B06.B1
MEM_FINISH
  Top 0.381: 307.98,155.57 312.42,155.57 312.42,156.84 B08.N1 | 307.98,155.57 305.44,155.57 292.1,168.91 292.1,245.75 287.65,245.75 A10.F1 | 307.98,155.57 307.98,158.12 306.7,159.38 306.7,163.19 B08.L2
MEM_START  (via drill 0.61)
  Top 0.381: v316.23,182.88 316.23,185.42 B08.C1 315.6,186.06 314.32,187.32 314.32,189.87 v309.25,194.94 | D32.M2 5.08,27.3 6.35,28.57 6.35,58.42 12.7,64.77 v12.7,205.1 12.7,219.71 5.08,227.33 5.08,229.87 A32.M2
  Bottom 0.381: v316.23,182.88 318.13,180.97 327.02,180.97 328.3,179.71 B07.E1 | v309.25,194.94 127,194.94 116.84,205.1 v12.7,205.1
N$1
  Top 0.381: AB02.BK2 385.44,167 382.9,169.54 AB02.BJ2 382.9,170.18 382.9,172.72 387.35,177.16 387.35,200.03 394.97,207.65 AB01.AV2
N$2
  Top 0.381: B06.E1 341,179.71 338.45,182.25 B06.D1 338.45,182.88 341,185.42 B06.C1
N$3
  Top 0.381: A25.F2 90.17,245.75 88.9,244.47 88.9,123.19 92.08,120.02 92.08,101.6 90.81,100.33 C25.L2
  Bottom 0.381: D25.L2 90.17,30.48 85.72,34.92 85.72,88.9 88.27,88.9 92.08,92.71 92.08,99.69 90.81,99.69 C25.L2
N$4  (via drill 0.61)
  Top 0.381: v107.31,244.47 117.47,234.31 v117.47,98.42
  Bottom 0.381: D25.U2 93.34,8.26 93.34,12.7 92.71,12.7 92.08,13.34 92.08,34.92 89.53,34.92 88.9,35.56 88.9,77.47 93.34,77.47 C25.U2 93.98,78.11 97.16,78.11 v117.47,98.42 | v107.31,244.47 104.78,244.47 103.5,245.75 A24.F2
N$5
  Bottom 0.381: B16.R2 205.1,150.5 206.38,149.22 314.96,149.22 322.58,156.84 325.12,156.84 B07.N1
N$6  (via drill 0.61)
  Top 0.381: v260.99,190.5 209.55,139.06 209.55,138.43 205.1,138.43 B16.V2
  Bottom 0.381: 302.26,190.5 311.15,190.5 312.42,189.23 B08.B1 | 302.26,190.5 v260.99,190.5 | 302.26,190.5 308.61,184.15 323.85,184.15 325.12,182.88 B07.D1
N$7
  Top 0.381: B07.F1 325.75,176.53 327.02,177.8 327.02,190.5 328.3,191.77 B07.A1
N$8
  Bottom 0.381: B08.D2 306.7,182.25 307.98,180.97 311.79,180.97 314.96,177.8 329.56,177.8 330.2,178.44 330.2,185.42 328.93,185.42 B07.C1
N$9
  Top 0.381: A07.M2 322.58,230.5 327.02,230.5 327.02,241.3 328.3,242.57 A07.H1
N$10
  Top 0.381: A07.K2 322.58,236.85 323.85,238.12 323.85,241.94 328.3,246.38 328.3,248.92 A07.E1
N$11
  Top 0.381: B16.M1 214.63,160.66 279.4,225.43 279.4,241.94 294.64,257.18 323.85,257.18 323.85,247.65 325.12,246.38 A07.F1
N$12
  Bottom 0.381: A08.H2 309.88,242.57 311.15,241.3 323.85,241.3 325.12,240.03 A07.J1
N$13
  Top 0.381: A08.T2 306.7,214.63 307.98,215.9 307.98,243.84 313.06,248.92 315.6,248.92 A08.E1
N$14
  Top 0.381: A08.F1 312.42,245.75 311.15,244.47 311.15,205.1 307.98,201.93 307.98,189.87 311.15,186.69 311.15,181.61 315.6,177.16 315.6,173.35 B08.H1
N$15  (via drill 0.61)
  Top 0.381: v317.5,243.84 317.5,213.36 333.38,197.49 333.38,176.53 337.82,176.53 B06.F1
  Bottom 0.381: v317.5,243.84 316.87,244.47 298.45,244.47 297.18,243.21 A09.H2
N$16
  Top 0.381: A09.K2 297.18,236.85 298.45,238.12 298.45,241.94 302.89,246.38 302.89,248.92 A09.E1
N$17
  Bottom 0.381: A09.L2 294,233.68 294,238.12 300.99,238.12 302.89,240.03 302.89,242.57 A09.H1
N$18  (via drill 0.61)
  Top 0.381: v295.27,205.1 295.27,245.75 299.72,245.75 A09.F1 | v317.5,196.22 317.5,184.15 318.77,182.88 B07.D2
  Bottom 0.381: v295.27,205.1 314.32,205.1 317.5,201.93 v317.5,196.22
N$19
  Top 0.381: D25.M1 100.33,27.3 101.6,28.57 101.6,95.25 100.33,96.52 C25.M1
  Bottom 0.381: B25.F2 90.17,175.9 90.17,171.45 89.53,171.45 88.9,170.81 88.9,101.6 92.71,101.6 97.16,97.16 99.69,97.16 C25.M1
N$20
  Top 0.381: 101.6,114.3 101.6,102.23 98.42,99.06 98.42,47.62 99.69,46.35 D25.E1 | 101.6,114.3 100.33,115.57 C25.E1 | 101.6,114.3 101.6,174.62 102.87,175.9 B24.F2
N$21  (via drill 0.61)
  Top 0.381: v314.96,161.93 317.5,164.47 317.5,174.62 318.77,175.9 B07.F2
  Bottom 0.381: v314.96,161.93 306.7,161.93 306.7,157.48 B08.N2
N$22
  Bottom 0.381: B16.K2 208.28,166.37 208.28,161.93 295.27,161.93 306.07,151.13 B08.R2
N$23  (via drill 0.61)
  Top 0.381: v303.53,171.45 301.62,173.35 301.62,238.12 300.36,239.4 A09.J1
  Bottom 0.381: A10.H2 284.48,242.57 285.75,241.3 298.45,241.3 299.72,240.03 A09.J1 | v303.53,171.45 323.85,171.45 325.12,170.18 B07.J1
N$24
  Top 0.381: A10.T2 281.31,214.63 285.75,214.63 285.75,247.01 287.65,248.92 290.19,248.92 A10.E1
N$25
  Top 0.381: B08.R1 313.06,151.13 314.32,152.4 314.32,154.94 325.75,166.37 328.3,166.37 B07.K1
READ  (via drill 0.61)
  Top 0.381: D25.L1 97.16,30.48 98.42,31.75 98.42,46.35 97.16,47.62 97.16,48.9 D25.D1 | C25.M2 93.34,96.52 92.71,95.89 92.71,93.34 91.44,92.08 88.9,92.08 88.9,117.47 90.17,118.75 C25.D2 | v120.02,114.3 272.42,114.3 314.32,156.21 314.32,158.12 313.69,158.75 313.69,162.56 313.06,163.19 B08.L1
  Bottom 0.381: 106.05,100.33 100.97,95.25 95.25,95.25 93.98,96.52 C25.M2 | 106.05,100.33 v120.02,114.3 | 106.05,100.33 118.75,100.33 118.75,68.58 100.97,50.8 98.42,50.8 97.16,49.53 D25.D1
V2
  Top 0.381: D25.V2 90.17,5.08 87.63,7.62 87.63,71.75 90.17,74.3 C25.V2
VCC  (via drill 0.61)
  Top 0.508: v102.87,121.92 v102.87,67.94 | v146.05,127.64 207.65,189.23 207.65,191.77 B16.A2 | AB02.AA2 385.44,261.62 384.18,260.35 384.18,193.68 385.44,192.41 AB02.BA2
  Bottom 0.508: 295.27,260.35 285.75,260.35 284.48,261.62 A10.A2 | 295.27,260.35 296.55,261.62 A09.A2 | 307.98,260.35 309.25,261.62 A08.A2 | 307.98,260.35 295.27,260.35 | 320.68,260.35 321.94,261.62 A07.A2 | 320.68,260.35 307.98,260.35 | 320.68,260.35 384.18,260.35 385.44,261.62 AB02.AA2 | v102.87,67.94 93.98,59.05 D25.A2 | C25.A2 93.98,128.27 96.52,128.27 v102.87,121.92 108.58,127.64 v146.05,127.64 | 307.98,193.68 209.55,193.68 208.28,192.41 B16.A2 | 307.98,193.68 309.25,192.41 B08.A2 | 320.68,193.68 321.94,192.41 B07.A2 | 320.68,193.68 307.98,193.68 | 333.38,193.68 334.64,192.41 B06.A2 | 320.68,193.68 333.38,193.68 | 333.38,193.68 384.18,193.68 385.44,192.41 AB02.BA2
WRITE  (via drill 0.61)
  Top 0.381: D25.M2 93.98,27.3 95.25,28.57 95.25,46.99 93.34,48.9 90.81,48.9 D25.D2 | C25.L1 97.16,100.33 98.42,101.6 98.42,117.47 97.16,118.75 C25.D1 | v314.32,130.81 314.32,146.05 315.6,147.32 B08.S1
  Bottom 0.381: v314.32,130.81 304.17,120.65 121.28,120.65 | 121.28,120.65 98.42,120.65 97.16,119.38 C25.D1 | 121.28,120.65 121.28,69.85 95.89,44.45 90.81,44.45 90.81,48.9 D25.D2
X_RETURN  (via drill 0.61)
  Top 0.381: v87.63,177.8 85.72,175.9 85.72,81.92 92.08,75.56 92.08,71.75 88.9,68.58 88.9,44.45 90.17,43.18 D25.F2
  Bottom 0.381: D25.F2 90.81,42.55 90.81,38.1 92.71,38.1 97.16,33.66 99.69,33.66 D25.K1 | v87.63,177.8 90.17,177.8 90.17,182.25 B25.D2
X_SOURCE  (via drill 0.61)
  Top 0.381: v113.67,250.82 120.02,244.47 v120.02,119.38
  Bottom 0.381: C25.F2 90.81,112.39 90.81,107.95 92.71,107.95 97.16,103.5 99.69,103.5 C25.K1 100.33,103.5 104.14,103.5 v120.02,119.38 | v113.67,250.82 92.08,250.82 90.81,252.09 A25.D2
Y_RETURN  (via drill 0.61)
  Top 0.381: D25.P2 93.98,20.32 98.42,20.32 98.42,15.88 99.69,14.61 D25.S1 | v118.75,43.18 118.75,239.4 107.95,250.19 107.95,252.09 103.5,252.09 A24.D2
  Bottom 0.381: v118.75,43.18 96.52,20.95 93.98,20.95 D25.P2
Y_SOURCE  (via drill 0.61)
  Top 0.381: v114.94,99.06 114.94,168.28 107.95,175.26 107.95,182.25 103.5,182.25 B24.D2
  Bottom 0.381: C25.P2 93.98,90.17 93.98,85.72 98.42,85.72 99.69,84.45 C25.S1 100.33,84.45 v114.94,99.06